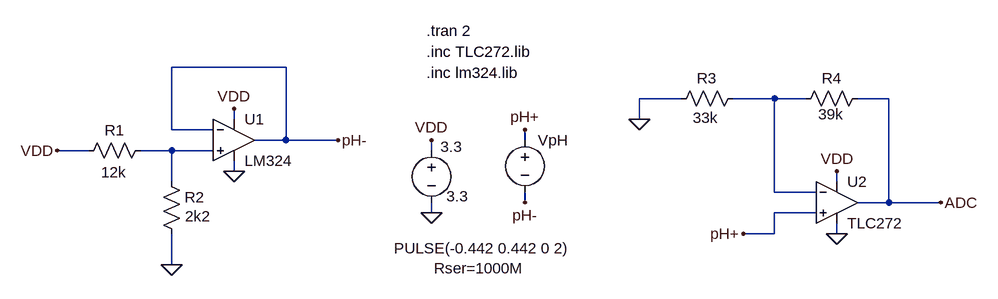
[diagram p0: schematic ph.asc]
ph.asc, the LTspice schematic file:
Version 4
SHEET 1 956 680
WIRE -1312 -112 -1488 -112
WIRE -704 -64 -768 -64
WIRE -560 -64 -624 -64
WIRE -512 -64 -560 -64
WIRE -384 -64 -432 -64
WIRE -1392 -32 -1392 -48
WIRE -768 -32 -768 -64
WIRE -1488 -16 -1488 -112
WIRE -1424 -16 -1488 -16
WIRE -1312 0 -1312 -112
WIRE -1312 0 -1360 0
WIRE -1232 0 -1312 0
WIRE -944 0 -944 -16
WIRE -1616 16 -1664 16
WIRE -1488 16 -1536 16
WIRE -1424 16 -1488 16
WIRE -1088 16 -1088 0
WIRE -1392 48 -1392 32
WIRE -1488 64 -1488 16
WIRE -464 64 -464 48
WIRE -560 80 -560 -64
WIRE -496 80 -560 80
WIRE -944 96 -944 80
WIRE -384 96 -384 -64
WIRE -384 96 -432 96
WIRE -304 96 -384 96
WIRE -1088 112 -1088 96
WIRE -496 112 -560 112
WIRE -560 144 -560 112
WIRE -560 144 -608 144
WIRE -464 144 -464 128
WIRE -1488 192 -1488 144
FLAG -944 -16 pH+
FLAG -944 96 pH-
FLAG -1088 112 0
FLAG -1088 0 VDD
FLAG -1392 48 0
FLAG -1392 -48 VDD
FLAG -1488 192 0
FLAG -1232 0 pH-
FLAG -1664 16 VDD
FLAG -608 144 pH+
FLAG -464 144 0
FLAG -464 48 VDD
FLAG -304 96 ADC
FLAG -768 -32 0
SYMBOL voltage -944 -16 R0
WINDOW 123 0 0 Left 0
WINDOW 39 -140 213 Left 2
WINDOW 0 20 16 Left 2
WINDOW 3 -202 182 Left 2
SYMATTR SpiceLine Rser=1000M
SYMATTR InstName VpH
SYMATTR Value PULSE(-0.442 0.442 0 2)
SYMBOL voltage -1088 0 R0
WINDOW 123 0 0 Left 0
WINDOW 39 0 0 Left 0
WINDOW 0 14 10 Left 2
WINDOW 3 23 86 Left 2
SYMATTR InstName 3.3
SYMATTR Value 3.3
SYMBOL Opamps\\opamp2 -1392 -64 R0
SYMATTR InstName U1
SYMATTR Value LM324
SYMBOL res -1520 0 R90
WINDOW 0 0 56 VBottom 2
WINDOW 3 65 57 VBottom 2
SYMATTR InstName R1
SYMATTR Value 12k
SYMBOL res -1504 48 R0
WINDOW 3 37 69 Left 2
SYMATTR Value 2k2
SYMATTR InstName R2
SYMBOL Opamps\\opamp2 -464 32 R0
SYMATTR InstName U2
SYMATTR Value TLC272
SYMBOL res -608 -80 R90
WINDOW 0 0 56 VBottom 2
WINDOW 3 61 58 VBottom 2
SYMATTR InstName R3
SYMATTR Value 33k
SYMBOL res -416 -80 R90
WINDOW 0 0 56 VBottom 2
WINDOW 3 56 57 VBottom 2
SYMATTR InstName R4
SYMATTR Value 39k
TEXT -1096 -168 Left 2 !.tran 2
TEXT -1096 -136 Left 2 !.inc TLC272.lib
TEXT -1096 -104 Left 2 !.inc lm324.lib

The netlist it stands for:
* ph.asc
VpH pH+ pH- PULSE(-0.442 0.442 0 2) Rser=1000M
V§3.3 VDD 0 3.3
XU1 N002 pH- VDD 0 pH- LM324  ; pins In+ In- V+ V- OUT
R1 N002 VDD 12k
R2 N002 0 2k2
XU2 pH+ N001 VDD 0 ADC TLC272  ; pins In+ In- V+ V- OUT
R3 N001 0 33k
R4 ADC N001 39k
.tran 2
.inc TLC272.lib
.inc lm324.lib
.backanno
.end